# Altium schematic sheet CurrentSense.SchDoc
size A; SheetNumber: 5; SheetTotal: 8
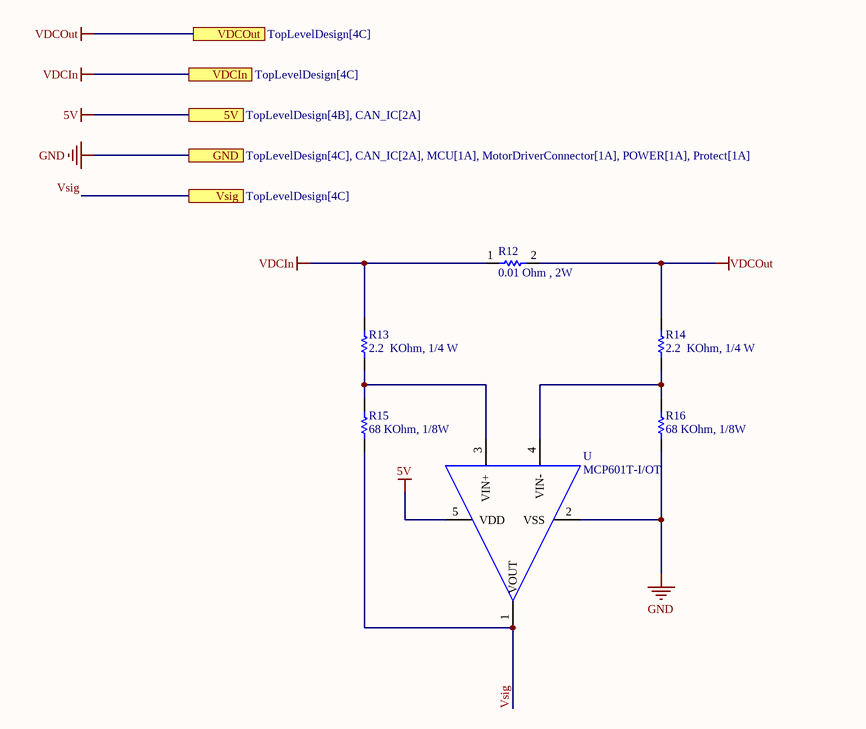
[diagram p0: CurrentSense.SchDoc]

## Parts
R12  0.01 Ohm , 2W  [FP-WSLP2512R0100FEA-IPC_A]
R13  value 2.2  KOhm, 1/4 W  [resistor_0603]  (hidden comment: 0006032221)
R14  value 2.2  KOhm, 1/4 W  [resistor_0603]  (hidden comment: 0006032221)
R15  value 68 KOhm, 1/8W  [RESISTOR_0805]  (hidden comment: 0008056835)
R16  value 68 KOhm, 1/8W  [RESISTOR_0805]  (hidden comment: 0008056835)
U  MCP601T-I/OT  [SOT95P280X145-5N]

## Ports
5V (see TopLevelDesign[4B], CAN_IC[2A]), GND (see TopLevelDesign[4C], CAN_IC[2A], MCU[1A], MotorDriverConnector[1A], POWER[1A], Protect[1A]), VDCIn (see TopLevelDesign[4C]), VDCOut (see TopLevelDesign[4C]), Vsig (see TopLevelDesign[4C])

## Nets
5V: U.5(VDD) ; port 5V
GND: R16.1 U.2(VSS) ; port GND
VDCIn: R12.1 R13.2 ; port VDCIn
VDCOut: R12.2 R14.2 ; port VDCOut
Vsig: R15.1 U.1(VOUT) ; port Vsig
NetR13_1: R13.1 R15.2 U.3(VIN+)
NetR14_1: R14.1 R16.2 U.4(VIN-)

## Library data of the parts
R12 = CMP-009-00673-2: RES 0.01 OHM 1% 3W 2512; Temperature Coefficient: 75ppm/°C; Value: 10m; Case Code (Metric): 6432; Resistance Tolerance: 1%; Height: 0.635mm; Source: 2512.SchLib; Series: WSLP; Max Operating Temperature: 170°C; Power Rating: 3W; Lead Free: Lead Free; Length: 6.4mm; Resistor Type: Metal Strip; Weight: 0.001429oz; Packaging: Tape and Reel; Package Quantity: 2000; Min Operating Temperature: -65°C; RoHS Compliant: Yes; Component Type: Standard; Termination: SMD/SMT; Design Item ID: CMP-02407-010954-1; Case/Package: 2512; Width: 3.2mm; Tolerance: 1%; Pins: 2
R13 R14 = CMP-009-00278-1: RES, size 0603, 2.2  KOhm, 1/4 W; Manufacture  SN: OEM; Rated Power: 1/4 W; Resistance Tolerance: +/-1%; Design Item ID: 0006032221; ComponentLink2URL: N/A; Mounting Technology: SMT; Supplier 3 SN: N/A; ComponentLink4URL: N/A; Component Type: Standard; ComponentLink3Description: Supplier 2 URL; Pins: 2; ComponentLink4Description: Supplier 3 URL; ComponentLink1Description: Datasheet link; Supplier 2 URL: https://www.digikey.com/en/products/detail/yageo/RC0603FR-132K2L/13694214; ComponentLink2Description: Supplier 1 URL; ComponentLink3URL: https://www.digikey.com/en/products/detail/yageo/RC0603FR-132K2L/13694214; Supplier 1 Name: Mouser; Supplier 1 URL: https://www.mouser.vn/ProductDetail/YAGEO/SR0603FR-7T2K2L?qs=pfd5qewlna6SQQIuviAJZA%3D%3D; Source: Resistor_0603.SchLib; Supplier 2 Name: Digi-Key; Size: 0603; ComponentLink1URL: N/A; Manufacture  Name: OEM; Supplier 3 URL: N/A; Supplier 3 Name: thegioiic; Supplier 2 SN: 13-RC0603FR-132K2LTR-ND; Supplier 1 SN: 603-SR0603FR-7T2K2L
R15 R16 = CMP-009-00639-1: RES, size 0805, 68 KOhm, 1/8W; Resistance Tolerance: +/-1%; Supplier 3 Name: Thegioiic; Manufacture  Name: N/A; Supplier 1 SN: 71-CRCW0805J-68K; Supplier 1 Name: Mouser; Design Item ID: 0008056835; Mounting Technology: SMT; Size: 0805; Supplier 2 URL: https://www.digikey.com/en/products/detail/yageo/RC0805JR-0768KL/728364; ComponentLink4Description: Supplier 3 URL; ComponentLink2URL: https://www.mouser.vn/ProductDetail/Vishay-Dale/CRCW080568K0JNTA?qs=nQS51YdobUZaOBJTD9nqEw%3D%3D; Pins: 2; Source: Resistor_0805.SchLib; Supplier 3 URL: N/A; Component Type: Standard; ComponentLink4URL: N/A; ComponentLink3URL: https://www.digikey.com/en/products/detail/yageo/RC0805JR-0768KL/728364; Supplier 2 SN: 311-68KARTR-ND; ComponentLink2Description: Supplier 1 URL; ComponentLink3Description: Supplier 2 URL; Supplier 2 Name: Digi-Key; Supplier 1 URL: https://www.mouser.vn/ProductDetail/Vishay-Dale/CRCW080568K0JNTA?qs=nQS51YdobUZaOBJTD9nqEw%3D%3D; Manufacture  SN: N/A; Supplier 3 SN: N/A; Rated Power: 1/8 W; ComponentLink1URL: N/A; ComponentLink1Description: Datasheet link
U = CMP-014-00080-5: General Purpose Amplifier 1 Circuit Rail-to-Rail SOT-23-5; MF: Microchip; Price: None; Design Item ID: MCP601T-I/OT; Pins: 5; Case/Package: SOT-23 Microchip; Component Type: Standard; SnapEDA_Link: https://www.snapeda.com/parts/MCP601T-I/OT/Microchip/view-part/43729/?ref=snap; Value: *; Source: SnapEDAsch.SchLib; MP: MCP601T-I/OT; Availability: Unavailable